# Altium schematic sheet JTAG_USB.SchDoc
size A
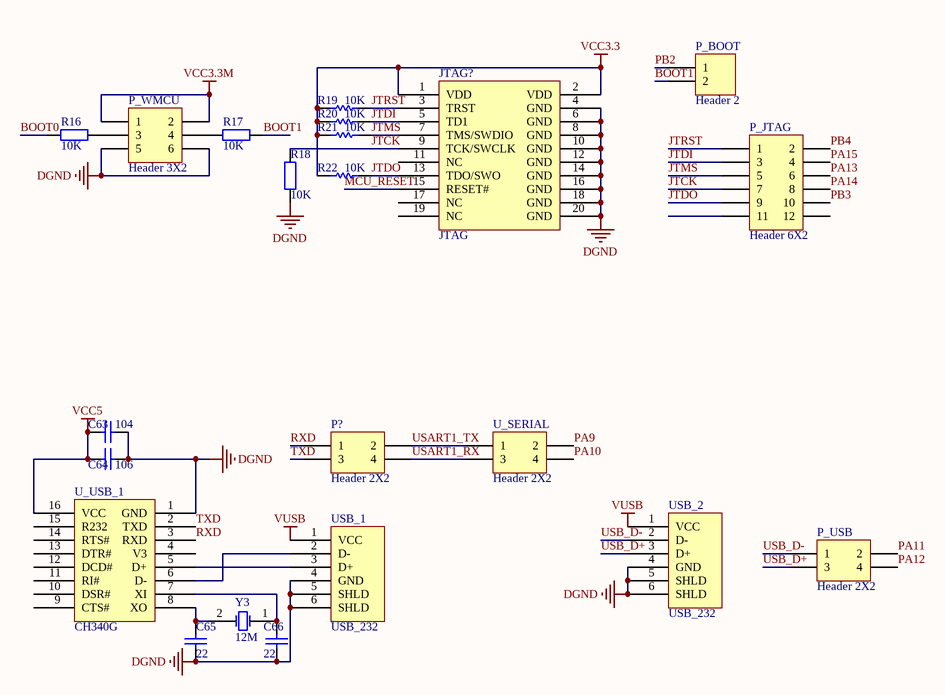
[diagram p0: JTAG_USB.SchDoc]

## Parts
C63  value 104  [SMT-0603]  (hidden comment: Cap)
C64  value 106  [SMT-0603]  (hidden comment: Cap)
C65  value 22  [SMT-0603]  (hidden comment: Cap)
C66  value 22  [SMT-0603]  (hidden comment: Cap)
JTAG?  JTAG  [JTAG20]
P?  Header 2X2  [HDR2X2]
P_BOOT  Header 2  [HDR1X2]
P_JTAG  Header 6X2  [HDR2X6]
P_USB  Header 2X2  [HDR2X2]
P_WMCU  Header 3X2  [HDR2X3]
R16  value 10K  [SMT-0603]  (hidden comment: Res2)
R17  value 10K  [SMT-0603]  (hidden comment: Res2)
R18  value 10K  [SMT-0603]  (hidden comment: Res2)
R19  10K  [SMT-0603]
R20  10K  [SMT-0603]
R21  10K  [SMT-0603]
R22  10K  [SMT-0603]
U_SERIAL  Header 2X2  [HDR2X2]
U_USB_1  CH340G  [SOP16]
USB_1  USB_232
USB_2  USB_232
Y3  12M  [D-CRYSTAL_UPRIGHT]

## Nets
DGND: C63.1 C64.1 C65.1 C66.1 JTAG?.4(GND) JTAG?.6(GND) JTAG?.8(GND) JTAG?.10(GND) JTAG?.12(GND) JTAG?.14(GND) JTAG?.16(GND) JTAG?.18(GND) JTAG?.20(GND) P_WMCU.5 P_WMCU.6 R18.1 U_USB_1.1(GND) USB_1.4(GND) USB_1.5(SHLD) USB_1.6(SHLD) USB_2.4(GND) USB_2.5(SHLD) USB_2.6(SHLD)
VCC3.3: JTAG?.1(VDD) JTAG?.2(VDD) R19.2 R20.2 R21.2 R22.2
VCC3.3M: P_WMCU.1 P_WMCU.2
VCC5: C63.2 C64.2 U_USB_1.16(VCC)
VUSB: USB_1.1(VCC) USB_2.1(VCC)
BOOT0: R16.1
BOOT1: P_BOOT.2 R17.2
JTCK: JTAG?.9(TCK/SWCLK) P_JTAG.7 R18.2
JTDI: JTAG?.5(TD1) P_JTAG.3 R20.1
JTDO: JTAG?.13(TDO/SWO) P_JTAG.9 R22.1
JTMS: JTAG?.7(TMS/SWDIO) P_JTAG.5 R21.1
JTRST: JTAG?.3(TRST) P_JTAG.1 R19.1
MCU_RESET: JTAG?.15(RESET#)
PA9: U_SERIAL.2
PA10: U_SERIAL.4
PA11: P_USB.2
PA12: P_USB.4
PA13: P_JTAG.6
PA14: P_JTAG.8
PA15: P_JTAG.4
PB2: P_BOOT.1
PB3: P_JTAG.10
PB4: P_JTAG.2
RXD: P?.1 U_USB_1.3(RXD)
TXD: P?.3 U_USB_1.2(TXD)
USART1_RX: P?.4 U_SERIAL.3
USART1_TX: P?.2 U_SERIAL.1
USB_D+: P_USB.3 USB_2.3(D+)
USB_D-: P_USB.1 USB_2.2(D-)
NetC65_2: C65.2 U_USB_1.8(XO) Y3.2(OSC2)
NetC66_2: C66.2 U_USB_1.7(XI) Y3.1(OSC1)
NetP_WMCU_3: P_WMCU.3 R16.2
NetP_WMCU_4: P_WMCU.4 R17.1
NetU_USB_1_5: U_USB_1.5(D+) USB_1.3(D+)
NetU_USB_1_6: U_USB_1.6(D-) USB_1.2(D-)

Not connected (* = marked no-connect by the designer): JTAG? 11(NC) 17(NC) 19(NC); P_JTAG 11 12; U_USB_1 4(V3) 9(CTS#) 10(DSR#) 11(RI#) 12(DCD#) 13(DTR#) 14(RTS#) 15(R232)

## Library data of the parts
C63-C66 = Cap: Capacitor; Published: 8-Jun-2000; LatestRevisionDate: 17-Jul-2002; LatestRevisionNote: Re-released for DXP Platform.; PackageReference: RAD-0.3; Publisher: Altium Limited; PackageDescription: Radial Cap, Thru-Hole; 2 Leads; 0.3 in Pin Spacing
P? P_USB U_SERIAL = Header 2X2: Header, 2-Pin, Dual row; LatestRevisionDate: 17-Jul-2002; LatestRevisionNote: Re-released for DXP Platform.; Publisher: Altium Limited
P_BOOT = Header 2: Header, 2-Pin; LatestRevisionDate: 17-Jul-2002; LatestRevisionNote: Re-released for DXP Platform.; Publisher: Altium Limited
P_JTAG = Header 6X2: Header, 6-Pin, Dual row; LatestRevisionDate: 17-Jul-2002; LatestRevisionNote: Re-released for DXP Platform.; Publisher: Altium Limited
P_WMCU = Header 3X2: Header, 3-Pin, Dual row; LatestRevisionDate: 17-Jul-2002; LatestRevisionNote: Re-released for DXP Platform.; Publisher: Altium Limited
R16-R18 = Res2: Resistor; Published: 8-Jun-2000; LatestRevisionDate: 17-Jul-2002; LatestRevisionNote: Re-released for DXP Platform.; PackageReference: AXIAL-0.4; Publisher: Altium Limited; PackageDescription: Axial Device, Thru-Hole; 2 Leads; 0.4 in Pin Spacing
R19-R22 = Res1: Resistor; Published: 8-Jun-2000; LatestRevisionDate: 17-Jul-2002; LatestRevisionNote: Re-released for DXP Platform.; PackageReference: AXIAL-0.3; Publisher: Altium Limited; Value: 10K
Y3 = XTAL: Crystal Oscillator; Published: 8-Jun-2000; LatestRevisionDate: 17-Jul-2002; LatestRevisionNote: Re-released for DXP Platform.; PackageReference: R38; Publisher: Altium Limited; PackageDescription: Crystal, Thru-Hole; 2 Leads; Body 3.1 x 8.2 mm (Dia.xH)